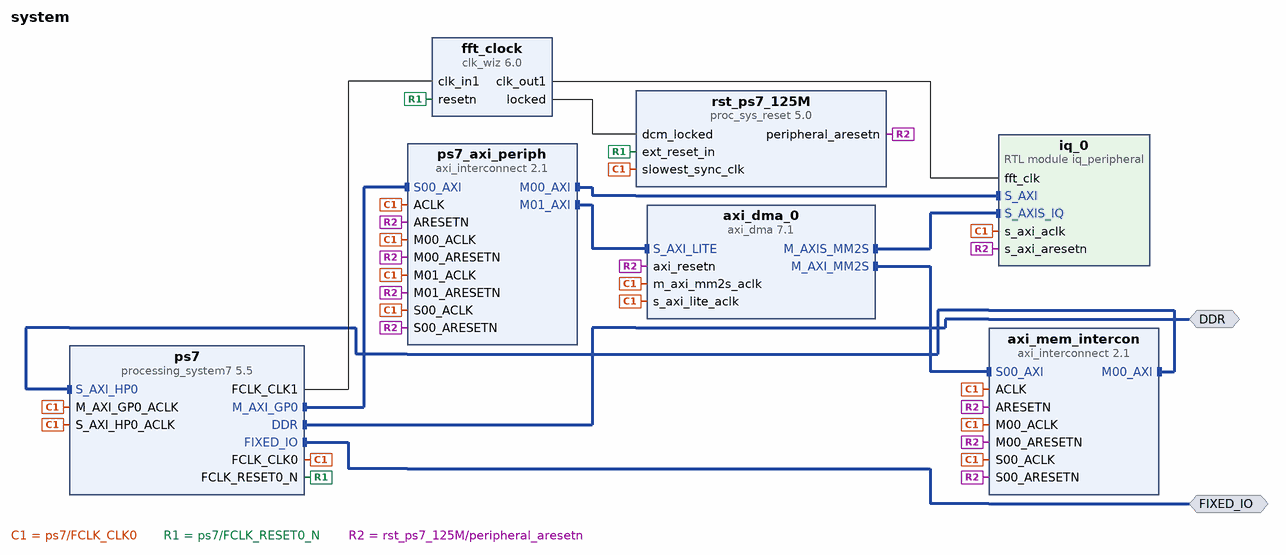
[diagram p0: block diagram of the top level]
# Vivado block design system, xc7z020clg400-1, Vivado 2026.1
create_bd_design system

create_bd_intf_port -mode Master -vlnv xilinx.com:interface:ddrx_rtl:1.0 DDR
create_bd_intf_port -mode Master -vlnv xilinx.com:display_processing_system7:fixedio_rtl:1.0 FIXED_IO

create_bd_cell -type ip -vlnv xilinx.com:ip:processing_system7:5.5 ps7
set_property -dict [list \
  CONFIG.PCW_APU_PERIPHERAL_FREQMHZ 666.666666 \
  CONFIG.PCW_ENET0_ENET0_IO {MIO 16 .. 27} \
  CONFIG.PCW_ENET0_GRP_MDIO_ENABLE 1 \
  CONFIG.PCW_ENET0_GRP_MDIO_IO {MIO 52 .. 53} \
  CONFIG.PCW_ENET0_PERIPHERAL_ENABLE 1 \
  CONFIG.PCW_ENET0_RESET_ENABLE 0 \
  CONFIG.PCW_ENET_RESET_ENABLE 1 \
  CONFIG.PCW_ENET_RESET_SELECT {Share reset pin} \
  CONFIG.PCW_EN_CLK1_PORT 1 \
  CONFIG.PCW_FCLK_CLK1_BUF TRUE \
  CONFIG.PCW_FPGA0_PERIPHERAL_FREQMHZ 125 \
  CONFIG.PCW_FPGA1_PERIPHERAL_FREQMHZ 125 \
  CONFIG.PCW_FPGA_FCLK1_ENABLE 1 \
  CONFIG.PCW_GPIO_MIO_GPIO_ENABLE 1 \
  CONFIG.PCW_GPIO_MIO_GPIO_IO MIO \
  CONFIG.PCW_I2C_RESET_ENABLE 1 \
  CONFIG.PCW_PRESET_BANK1_VOLTAGE {LVCMOS 1.8V} \
  CONFIG.PCW_QSPI_GRP_FBCLK_ENABLE 1 \
  CONFIG.PCW_QSPI_GRP_FBCLK_IO {MIO 8} \
  CONFIG.PCW_QSPI_GRP_SINGLE_SS_ENABLE 1 \
  CONFIG.PCW_QSPI_GRP_SINGLE_SS_IO {MIO 1 .. 6} \
  CONFIG.PCW_QSPI_PERIPHERAL_ENABLE 1 \
  CONFIG.PCW_QSPI_QSPI_IO {MIO 1 .. 6} \
  CONFIG.PCW_SD0_GRP_CD_ENABLE 1 \
  CONFIG.PCW_SD0_GRP_CD_IO {MIO 47} \
  CONFIG.PCW_SD0_GRP_WP_ENABLE 0 \
  CONFIG.PCW_SD0_PERIPHERAL_ENABLE 1 \
  CONFIG.PCW_SD0_SD0_IO {MIO 40 .. 45} \
  CONFIG.PCW_SDIO_PERIPHERAL_FREQMHZ 50 \
  CONFIG.PCW_SINGLE_QSPI_DATA_MODE x4 \
  CONFIG.PCW_UART1_PERIPHERAL_ENABLE 1 \
  CONFIG.PCW_UART1_UART1_IO {MIO 48 .. 49} \
  CONFIG.PCW_UART_PERIPHERAL_FREQMHZ 100 \
  CONFIG.PCW_UIPARAM_DDR_FREQ_MHZ 533.333333 \
  CONFIG.PCW_UIPARAM_DDR_MEMORY_TYPE {DDR 3 (Low Voltage)} \
  CONFIG.PCW_UIPARAM_DDR_PARTNO {MT41K256M16 RE-125} \
  CONFIG.PCW_USB0_PERIPHERAL_ENABLE 1 \
  CONFIG.PCW_USB0_RESET_ENABLE 1 \
  CONFIG.PCW_USB0_RESET_IO {MIO 46} \
  CONFIG.PCW_USB0_USB0_IO {MIO 28 .. 39} \
  CONFIG.PCW_USB_RESET_ENABLE 1 \
  CONFIG.PCW_USB_RESET_SELECT {Share reset pin} \
  CONFIG.PCW_USE_S_AXI_HP0 1 \
] [get_bd_cells ps7]
# 298 more settings of ps7 are not shown: defaults, MIO pin electricals, DDR timing, and values the tool derives
create_bd_cell -type module -reference iq_peripheral iq_0
create_bd_cell -type ip -vlnv xilinx.com:ip:axi_dma:7.1 axi_dma_0
set_property -dict [list \
  CONFIG.c_include_mm2s 1 \
  CONFIG.c_include_s2mm 0 \
  CONFIG.c_include_sg 0 \
  CONFIG.c_m_axis_mm2s_tdata_width 32 \
  CONFIG.c_mm2s_burst_size 16 \
  CONFIG.c_sg_length_width 23 \
] [get_bd_cells axi_dma_0]
create_bd_cell -type ip -vlnv xilinx.com:ip:clk_wiz:6.0 fft_clock
set_property -dict [list \
  CONFIG.CLKOUT1_REQUESTED_OUT_FREQ 150 \
  CONFIG.PRIM_IN_FREQ 125 \
  CONFIG.PRIM_SOURCE No_buffer \
  CONFIG.RESET_TYPE ACTIVE_LOW \
  CONFIG.USE_LOCKED true \
  CONFIG.USE_RESET true \
] [get_bd_cells fft_clock]
create_bd_cell -type ip -vlnv xilinx.com:ip:axi_interconnect:2.1 ps7_axi_periph
set_property -dict {CONFIG.NUM_MI 2} [get_bd_cells ps7_axi_periph]
create_bd_cell -type ip -vlnv xilinx.com:ip:proc_sys_reset:5.0 rst_ps7_125M
create_bd_cell -type ip -vlnv xilinx.com:ip:axi_interconnect:2.1 axi_mem_intercon
set_property -dict {CONFIG.NUM_MI 1} [get_bd_cells axi_mem_intercon]

# ---- connections ----

connect_bd_intf_net [get_bd_intf_pins axi_dma_0/M_AXIS_MM2S] [get_bd_intf_pins iq_0/S_AXIS_IQ]
connect_bd_intf_net [get_bd_intf_pins axi_dma_0/M_AXI_MM2S] [get_bd_intf_pins axi_mem_intercon/S00_AXI]
connect_bd_intf_net [get_bd_intf_pins axi_mem_intercon/M00_AXI] [get_bd_intf_pins ps7/S_AXI_HP0]
connect_bd_intf_net [get_bd_intf_ports DDR] [get_bd_intf_pins ps7/DDR]
connect_bd_intf_net [get_bd_intf_ports FIXED_IO] [get_bd_intf_pins ps7/FIXED_IO]
connect_bd_intf_net [get_bd_intf_pins ps7/M_AXI_GP0] [get_bd_intf_pins ps7_axi_periph/S00_AXI]
connect_bd_intf_net [get_bd_intf_pins ps7_axi_periph/M00_AXI] [get_bd_intf_pins iq_0/S_AXI]
connect_bd_intf_net [get_bd_intf_pins ps7_axi_periph/M01_AXI] [get_bd_intf_pins axi_dma_0/S_AXI_LITE]
connect_bd_net [get_bd_pins fft_clock/clk_out1] [get_bd_pins iq_0/fft_clk]
connect_bd_net [get_bd_pins fft_clock/locked] [get_bd_pins rst_ps7_125M/dcm_locked]
connect_bd_net [get_bd_pins ps7/FCLK_CLK0] \
  [get_bd_pins ps7_axi_periph/ACLK] [get_bd_pins ps7/M_AXI_GP0_ACLK] [get_bd_pins ps7_axi_periph/S00_ACLK] \
  [get_bd_pins rst_ps7_125M/slowest_sync_clk] [get_bd_pins ps7_axi_periph/M00_ACLK] [get_bd_pins axi_dma_0/s_axi_lite_aclk] \
  [get_bd_pins ps7_axi_periph/M01_ACLK] [get_bd_pins axi_mem_intercon/ACLK] [get_bd_pins axi_dma_0/m_axi_mm2s_aclk] \
  [get_bd_pins axi_mem_intercon/S00_ACLK] [get_bd_pins ps7/S_AXI_HP0_ACLK] [get_bd_pins axi_mem_intercon/M00_ACLK] \
  [get_bd_pins iq_0/s_axi_aclk]
connect_bd_net [get_bd_pins ps7/FCLK_CLK1] [get_bd_pins fft_clock/clk_in1]
connect_bd_net [get_bd_pins ps7/FCLK_RESET0_N] [get_bd_pins fft_clock/resetn] [get_bd_pins rst_ps7_125M/ext_reset_in]
connect_bd_net [get_bd_pins rst_ps7_125M/peripheral_aresetn] \
  [get_bd_pins ps7_axi_periph/S00_ARESETN] [get_bd_pins ps7_axi_periph/M00_ARESETN] [get_bd_pins ps7_axi_periph/ARESETN] \
  [get_bd_pins axi_dma_0/axi_resetn] [get_bd_pins ps7_axi_periph/M01_ARESETN] [get_bd_pins axi_mem_intercon/S00_ARESETN] \
  [get_bd_pins axi_mem_intercon/M00_ARESETN] [get_bd_pins axi_mem_intercon/ARESETN] [get_bd_pins iq_0/s_axi_aresetn]

# ---- address map ----
assign_bd_address -offset 0x00000000 -range 1G -target_address_space [get_bd_addr_spaces axi_dma_0/Data_MM2S] [get_bd_addr_segs ps7/S_AXI_HP0/HP0_DDR_LOWOCM]
assign_bd_address -offset 0x40000000 -range 256K -target_address_space [get_bd_addr_spaces ps7/Data] [get_bd_addr_segs iq_0/S_AXI/reg0]
assign_bd_address -offset 0x40400000 -range 64K -target_address_space [get_bd_addr_spaces ps7/Data] [get_bd_addr_segs axi_dma_0/S_AXI_LITE/Reg]

validate_bd_design
save_bd_design
